# EAGLE design Monitor1 (EAGLE 9.6.2)
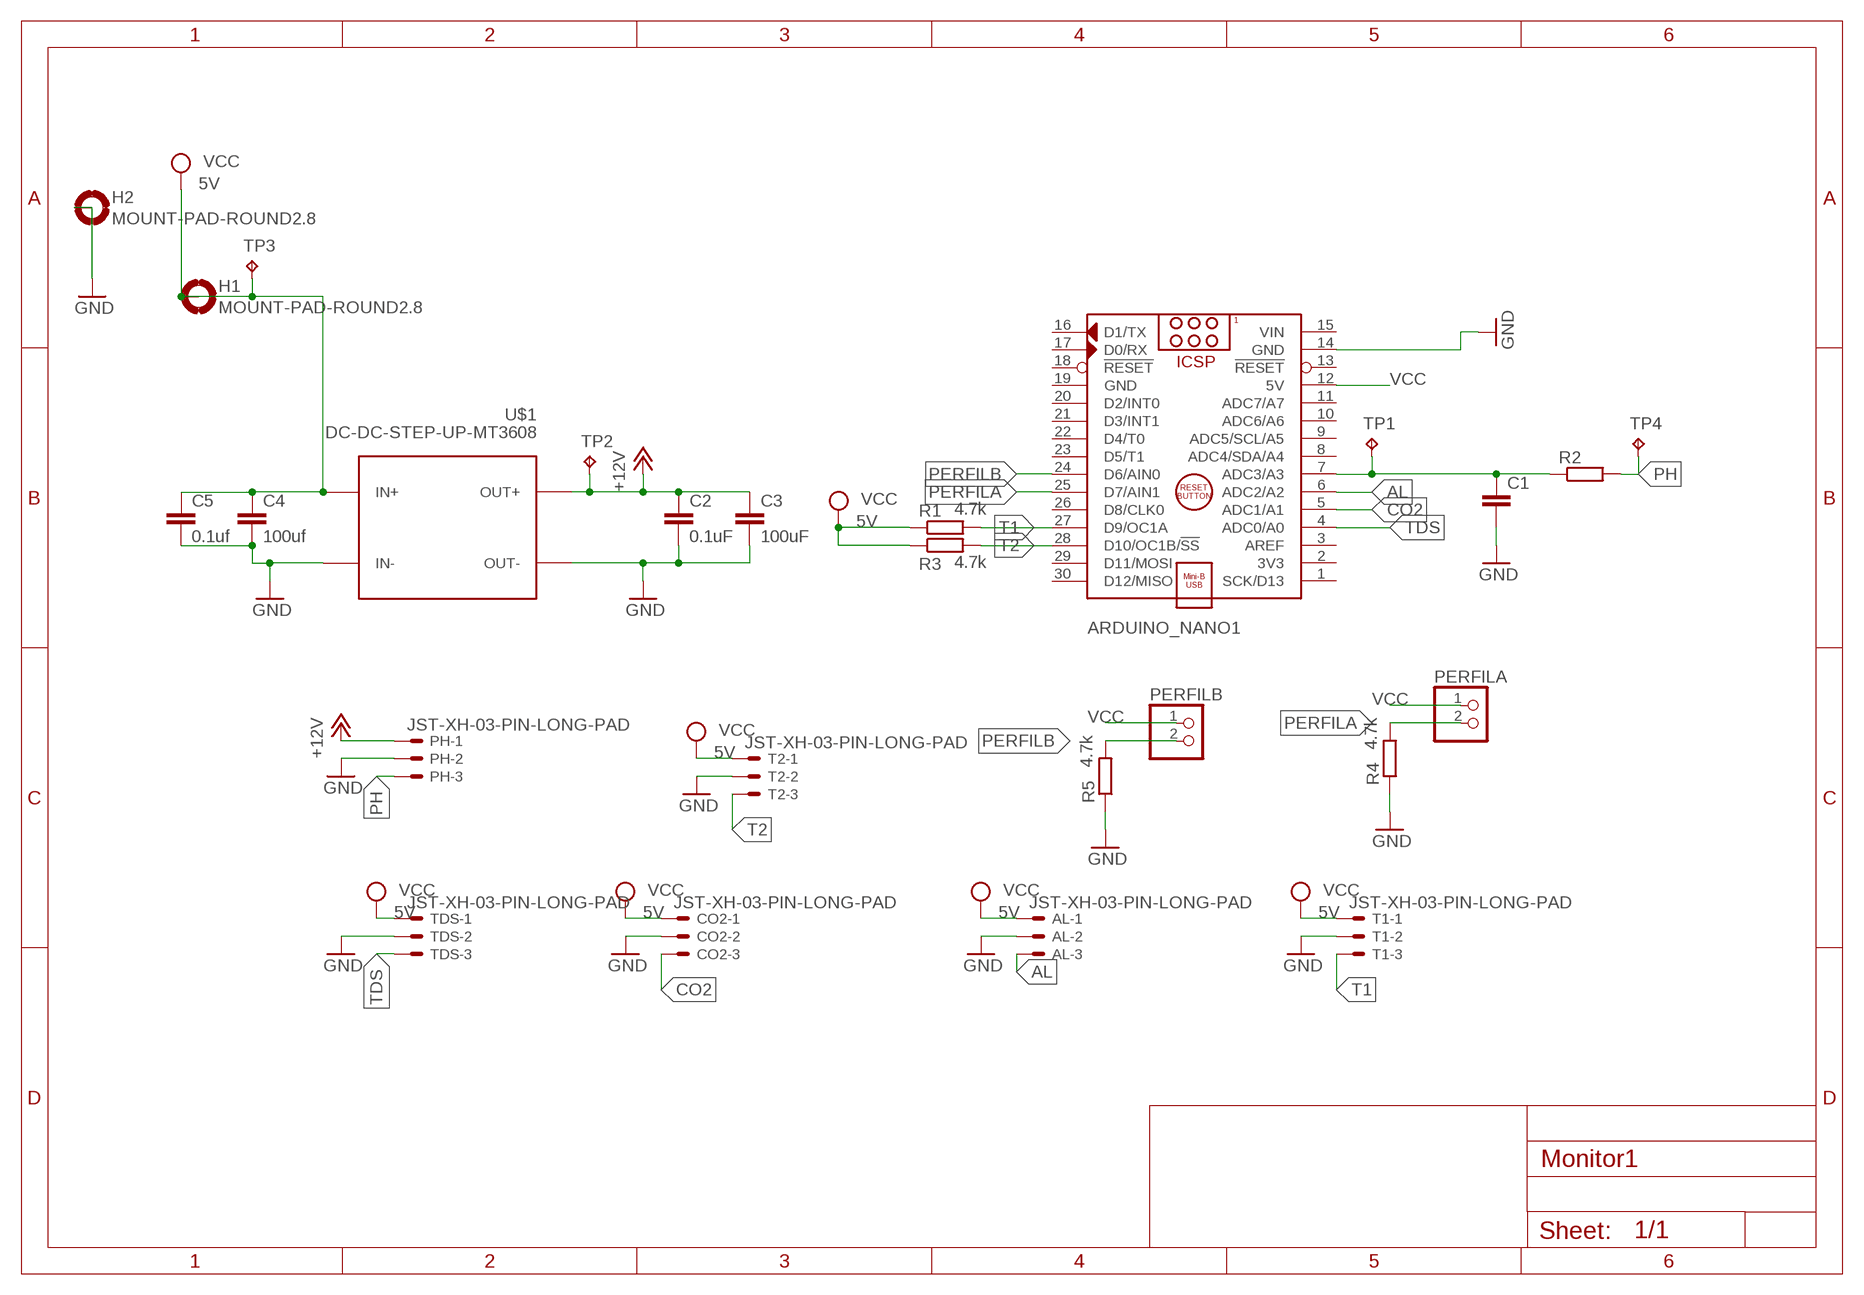
[diagram p0: schematic, sheet 1]

## Parts
AL  JST-XH-03-PIN-LONG-PAD  [JST-XH-03-PACKAGE-LONG-PAD]
ARDUINO_NANO1  ARDUINO_NANO  [ARDUINO_NANO]
C1  C-EU050-030X075  [C050-030X075]
C2  0.1uF  C-EU050-030X075  [C050-030X075]
C3  100uF  C-EU050-045X075  [C050-045X075]
C4  100uf  C-EU050-045X075  [C050-045X075]
C5  0.1uf  C-EU050-030X075  [C050-030X075]
CO2  JST-XH-03-PIN-LONG-PAD  [JST-XH-03-PACKAGE-LONG-PAD]
H1  MOUNT-PAD-ROUND2.8  [2,8-PAD]
H2  MOUNT-PAD-ROUND2.8  [2,8-PAD]
PERFILA  PINHD-1X2  [1X02]
PERFILB  PINHD-1X2  [1X02]
PH  JST-XH-03-PIN-LONG-PAD  [JST-XH-03-PACKAGE-LONG-PAD]
R1  4.7k  R-EU_0309/10  [0309/10]
R2  R-EU_0309/10  [0309/10]
R3  4.7k  R-EU_0309/10  [0309/10]
R4  4.7k  R-EU_0309/10  [0309/10]
R5  4.7k  R-EU_0309/10  [0309/10]
T1  JST-XH-03-PIN-LONG-PAD  [JST-XH-03-PACKAGE-LONG-PAD]
T2  JST-XH-03-PIN-LONG-PAD  [JST-XH-03-PACKAGE-LONG-PAD]
TDS  JST-XH-03-PIN-LONG-PAD  [JST-XH-03-PACKAGE-LONG-PAD]
TP1  TPPAD1-13  [P1-13]
TP2  TPPAD1-13  [P1-13]
TP3  TPPAD1-13  [P1-13]
TP4  TPPAD1-13  [P1-13]
U$1  DC-DC-STEP-UP-MT3608  [DC-DC-STEP-UP-MT3608]

## Nets
+12V: C2.1 C3.1 PH.1 TP2.TP U$1.OUT+
AL: AL.3 ARDUINO_NANO1.6(ADC2/A2)
CO2: ARDUINO_NANO1.5(ADC1/A1) CO2.3
GND: AL.2 ARDUINO_NANO1.14(GND) C1.2 C2.2 C3.2 C4.2 C5.2 CO2.2 H2.B2,8(MOUNT) PH.2 R4.1 R5.1 T1.2 T2.2 TDS.2 U$1.IN- U$1.OUT-
N$2: ARDUINO_NANO1.7(ADC3/A3) C1.1 R2.1 TP1.TP
PERFILA: ARDUINO_NANO1.25(D7/AIN1) PERFILA.2 R4.2
PERFILB: ARDUINO_NANO1.24(D6/AIN0) PERFILB.2 R5.2
PH: PH.3 R2.2 TP4.TP
T1: ARDUINO_NANO1.27(D9/OC1A) R1.2 T1.3
T2: ARDUINO_NANO1.28(D10/OC1B/!SS) R3.2 T2.3
TDS: ARDUINO_NANO1.4(ADC0/A0) TDS.3
VCC: AL.1 ARDUINO_NANO1.12(5V) C4.1 C5.1 CO2.1 H1.B2,8(MOUNT) PERFILA.1 PERFILB.1 R1.1 R3.1 T1.1 T2.1 TDS.1 TP3.TP U$1.IN+
Unconnected: ARDUINO_NANO1.1(SCK/D13) ARDUINO_NANO1.2(3V3) ARDUINO_NANO1.3(AREF) ARDUINO_NANO1.8(ADC4/SDA/A4) ARDUINO_NANO1.9(ADC5/SCL/A5) ARDUINO_NANO1.10(ADC6/A6) ARDUINO_NANO1.11(ADC7/A7) ARDUINO_NANO1.13(!RESET) ARDUINO_NANO1.16(D1/TX) ARDUINO_NANO1.17(D0/RX) ARDUINO_NANO1.18(!RESET) ARDUINO_NANO1.20(D2/INT0) ARDUINO_NANO1.21(D3/INT1) ARDUINO_NANO1.22(D4/T0) ARDUINO_NANO1.23(D5/T1) ARDUINO_NANO1.26(D8/CLK0) ARDUINO_NANO1.29(D11/MOSI) ARDUINO_NANO1.30(D12/MISO)

## Power pins joined to a net without a drawn wire
GND: ARDUINO_NANO1.19(GND)
VIN: ARDUINO_NANO1.15(VIN)

## Library data of the parts
AL CO2 PH T1 T2 TDS = Rembrandt Electronics - JST XH Connectors v1-0:JST-XH-03-PIN: JST XH Connector 2 Pin Wire to board connector. Pitch: 2,54 mm, (0.100") Number of pins: 3 Created by Rembrandt Electronics www.rembrandtelectronics.com
ARDUINO_NANO1 = ArduinoNanoV30:ARDUINO_NANO: Arduino Nano V3.0 Module Overview: The Arduino Nano is a small, complete, and breadboard-friendly board based on the ATmega328 (Arduino Nano 3.x) or ATmega168 (Arduino Nano 2.x). It has more or less the same functionality of the Arduino Duemilanove, but in a different package. It lacks only a DC power jack, and works with a Mini-B USB cable instead of a standard one. The Nano was designed and is being produced by Gravitech <http://www.gravitech.us/arna30wiatp.html>. General specifications: Item Value Microcontroller Atmel ATmega168 or ATmega328 Operating Voltage (logic level) 5 V Input Voltage (recommended) 7-12 V Input Voltage (limits) 6-20 V Digital I/O Pins 14 (of which 6 provide PWM output) Analog Input Pins 8 DC Current per I/O Pin 40 mA Flash Memory 16 KB (ATmega168) or 32 KB (ATmega328) of which 2 KB used by bootloader SRAM 1 KB (ATmega168) or 2 KB (ATmega328) EEPROM 512 bytes (ATmega168) or 1 KB (ATmega328) Clock Speed 16 MHz Dimensions (Inches) 0.73" x 1.70" Dimensions (mm) 18mm x 45mm Overall height About 9 mm (not including pins) Weigth 5 g Power: The Arduino Nano can be powered via the Mini-B USB connection, 6-20V unregulated external power supply (pin 30), or 5V regulated external power supply (pin 27). The power source is automatically selected to the highest voltage source. Memory: The ATmega168 has 16 KB of flash memory for storing code (of which 2 KB is used for the bootloader); the ATmega328 has 32 KB, (also with 2 KB used for the bootloader). The ATmega168 has 1 KB of SRAM and 512 bytes of EEPROM (which can be read and written with the EEPROM library); the ATmega328 has 2 KB of SRAM and 1 KB of EEPROM. Input and Output: Each of the 14 digital pins on the Nano can be used as an input or output, using pinMode(), digitalWrite(), and digitalRead() functions. They operate at 5 volts. Each pin can provide or receive a maximum of 40 mA and has an internal pull-up resistor (disconnected by default) of 20-50 kOhms. In addition, some pins have specialized functions. Visit Arduino - ArduinoBoardNano <https://www.arduino.cc/en/Main/ArduinoBoardNano>
C1-C5 = rcl:C-EU: CAPACITOR, European symbol; SPICEPREFIX: C
H1 H2 = holes:MOUNT-PAD-ROUND: MOUNTING PAD, round
PERFILA PERFILB = pinhead:PINHD-1X2: PIN HEADER
R1-R5 = rcl:R-EU_: RESISTOR, European symbol; SPICEPREFIX: R
TP1-TP4 = testpad:TP: Test pad
U$1 = diy-modules:DC-DC-STEP-UP-MT3608: DC/DC Step-Up Regulator based on MT3608 chip MT3608 datasheet available here: https://www.olimex.com/Products/Breadboarding/BB-PWR-3608/resources/MT3608.pdf Click here to find device on ebay.com <http://www.ebay.com/sch/mt3608+module>

## Board
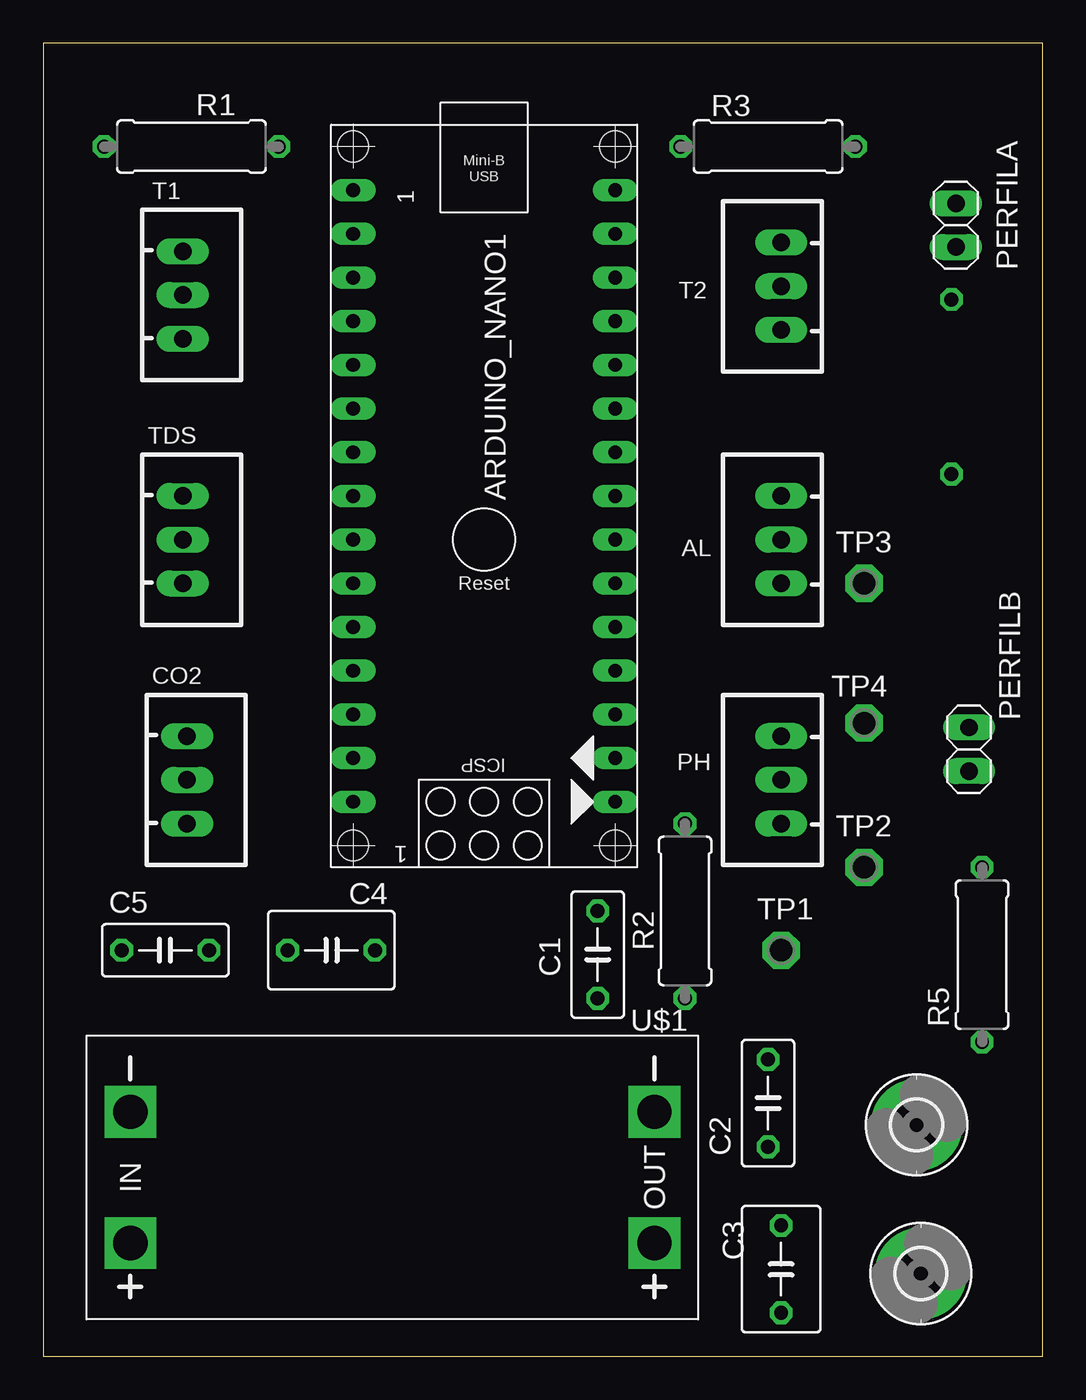
[diagram p1: board, top side]
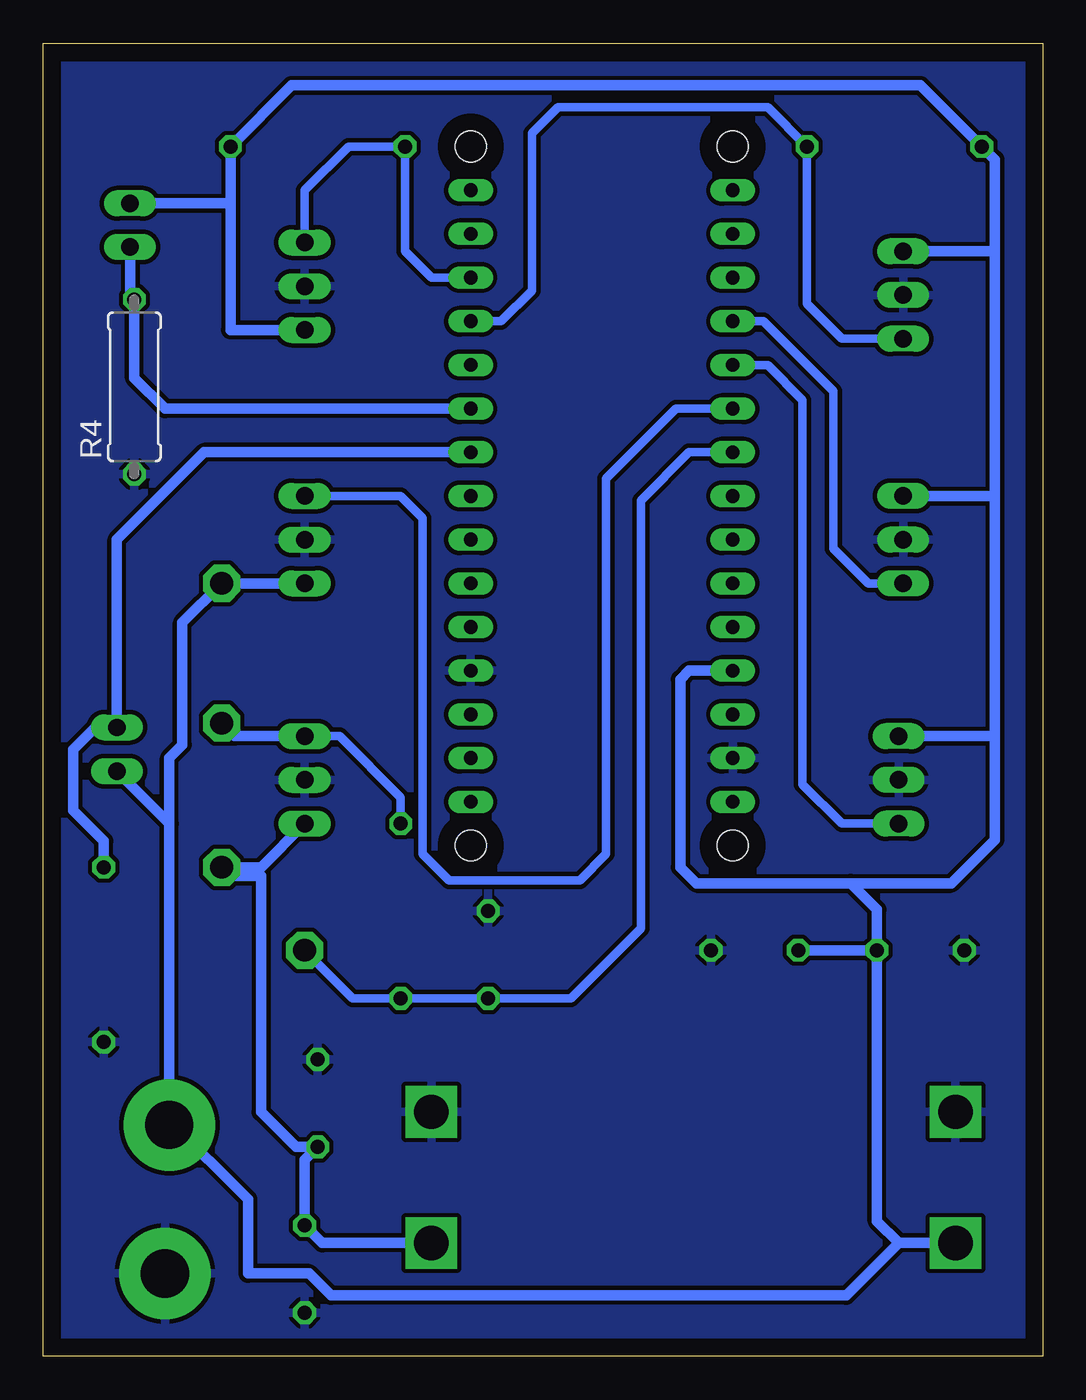
[diagram p2: board, bottom side, seen from below]

Size 58.15 x 76.38 mm. Coordinates in mm from the lower left corner, seen from the top.
Outline: 0,0 58.15,0 58.15,76.38 0,76.38 0,0
Copper layers (1*16): Top 0.035mm / dielectric 1.5mm / Bottom 0.035mm
Design rules "default": minimum track width 6mil, minimum drill 0.35mm, track to track 6mil, track to pad 6mil, pad to pad 6mil, via to via 6mil, smd to smd 6mil, copper to edge 40mil, drill to drill 6mil, minimum pad ring 10mil, minimum via ring 8mil, stop-mask expansion 4mil, vias tented up to drill 0mil, thermal gap 10mil

### Footprints (pad centres in the part's own frame; a part is rotated, then mirrored left to right if it is on the bottom)
JST-XH-03-PACKAGE-LONG-PAD = drill 1.016 long: 1 -2.54,0; 2 0,0; 3 2.54,0
ARDUINO_NANO = drill 0.8 long: 1 -20.32,-7.62; 2 -17.78,-7.62; 3 -15.24,-7.62; 4 -12.7,-7.62; 5 -10.16,-7.62; 6 -7.62,-7.62; 7 -5.08,-7.62; 8 -2.54,-7.62; 9 0,-7.62; 10 2.54,-7.62; 11 5.08,-7.62; 12 7.62,-7.62; 13 10.16,-7.62; 14 12.7,-7.62; 15 15.24,-7.62; 16 15.24,7.62; 17 12.7,7.62; 18 10.16,7.62; 19 7.62,7.62; 20 5.08,7.62; 21 2.54,7.62; 22 0,7.62; 23 -2.54,7.62; 24 -5.08,7.62; 25 -7.62,7.62; 26 -10.16,7.62; 27 -12.7,7.62; 28 -15.24,7.62; 29 -17.78,7.62; 30 -20.32,7.62 | hole 1.778: -22.86,-7.62; -22.86,7.62; 17.78,7.62; 17.78,-7.62
C050-030X075 = drill 0.813 octagon: 1 -2.54,0; 2 2.54,0
C050-045X075 = drill 0.813 octagon: 1 -2.54,0; 2 2.54,0
2,8-PAD = drill 2.8 pad 5.334: B2,8 0,0
1X02 = drill 1.016 long: 1 -1.27,0; 2 1.27,0
0309/10 = drill 0.813 octagon: 1 -5.08,0; 2 5.08,0
P1-13 = drill 1.321 pad 2.159 octagon: TP 0,0
DC-DC-STEP-UP-MT3608 = drill 2 pad 2.8 square: IN+ 15.24,3.81; IN- 15.24,-3.81; OUT+ -15.24,3.81; OUT- -15.24,-3.81

### Placement (x,y rotation side)
AL  42.93,47.5 90 top
ARDUINO_NANO1  25.65,47.5 270 top
C1  32.26,23.37 90 top
C2  42.16,14.73 90 top
C3  42.93,5.08 270 top
C4  16.76,23.62 0 top
C5  7.11,23.62 180 top
CO2  8.38,33.53 270 top
H1  50.8,13.46 0 top
H2  51.05,4.83 0 top
PERFILA  53.09,65.79 270 top
PERFILB  53.85,35.31 90 top
PH  42.93,33.53 90 top
R1  8.64,70.36 0 top
R2  37.34,25.91 90 top
R3  42.16,70.36 180 top
R4  52.83,56.39 90 bottom
R5  54.61,23.37 90 top
T1  8.13,61.72 270 top
T2  42.93,62.23 90 top
TDS  8.13,47.5 270 top
TP1  42.93,23.62 0 top
TP2  47.75,28.45 0 top
TP3  47.75,44.96 0 top
TP4  47.75,36.83 0 top
U$1  20.32,10.41 180 top

### Tracks (layer width: path | path; a pad name or v marks a point on that pad's centre or on a via)
+12V
  Bottom 0.61: PH.1 45.47,28.45 TP2.TP 47.24,27.94 45.47,27.94 45.47,14.22 43.43,12.19 C2.1 42.93,11.43 C3.1 41.91,6.6 U$1.OUT+
AL
  Bottom 0.508: AL.3 37.34,50.04 36.07,48.77 36.07,29.21 34.54,27.69 26.92,27.69 25.4,29.21 25.4,51.05 21.34,55.12 ARDUINO_NANO1.6
CO2
  Bottom 0.508: 17.27,57.66 ARDUINO_NANO1.5 16,57.66 13.97,55.63 13.97,33.27 11.68,30.99 CO2.3
GND
  pour Bottom (isolate 0.254): 1.02,75.44 57.15,75.44 57.15,0.51 1.02,0.51
N$2
  Bottom 0.508: TP1.TP 40.13,20.83 R2.1 C1.1 27.43,20.83 23.37,24.89 23.37,49.78 20.57,52.58 ARDUINO_NANO1.7
PERFILA
  Bottom 0.61: PERFILA.2 53.09,61.72 R4.2 52.83,56.9 51.05,55.12 ARDUINO_NANO1.25
PERFILB
  Bottom 0.61: 54.61,28.7 R5.2 54.61,29.97 56.39,31.75 56.39,35.31 55.12,36.58 PERFILB.2 53.85,47.5 48.77,52.58 ARDUINO_NANO1.24
PH
  Bottom 0.508: PH.3 40.89,36.07 37.34,32.51 R2.2
  Bottom 0.61: PH.3 46.99,36.07 TP4.TP
T1
  Bottom 0.508: ARDUINO_NANO1.27 31.5,60.2 29.72,61.98 29.72,71.12 28.19,72.64 16,72.64 R1.2 13.72,61.21 11.68,59.18 T1.3
T2
  Bottom 0.508: T2.3 42.93,67.82 40.39,70.36 R3.2 37.08,64.26 35.56,62.74 ARDUINO_NANO1.28
TDS
  Bottom 0.508: ARDUINO_NANO1.4 16.26,60.2 12.19,56.13 12.19,46.99 10.16,44.96 TDS.3
VCC
  Bottom 0.508: 6.1,6.86 5.84,6.6 U$1.IN+
  Bottom 0.61: CO2.1 2.79,36.07 | 2.79,64.26 2.79,69.6 R1.1 7.11,73.91 43.69,73.91 R3.1 47.24,67.06 | 2.79,64.26 2.79,50.04 | 2.79,50.04 2.79,36.07 | T1.1 2.79,64.26 | TDS.1 2.79,50.04 | 47.24,67.06 47.24,59.69 T2.1 | 47.24,45.47 47.62,45.09 | 47.62,45.09 TP3.TP 50.04,42.67 50.04,35.56 50.8,34.8 50.8,30.99 | AL.1 47.5,44.96 47.62,45.09 | ARDUINO_NANO1.12 20.57,39.88 21.08,39.37 21.08,28.45 20.14,27.51 11.18,27.51 | 11.18,27.51 5.33,27.51 2.79,30.05 2.79,36.07 | C4.1 C5.1 | C5.1 9.65,25.98 11.18,27.51 | U$1.IN+ 8.38,6.6 | C5.1 9.65,7.87 8.38,6.6 | 8.38,6.6 11.43,3.56 41.4,3.56 42.67,4.83 46.23,4.83 46.23,9.14 50.8,13.72 | PERFILA.1 47.24,67.06 | H1.B2,8 50.8,13.72 | 50.8,13.72 50.8,30.99 | PERFILB.1 50.8,30.99